# Altium schematic sheet 02_Block_Diagram.SchDoc
size A3; SheetNumber: 2; SheetTotal: 6
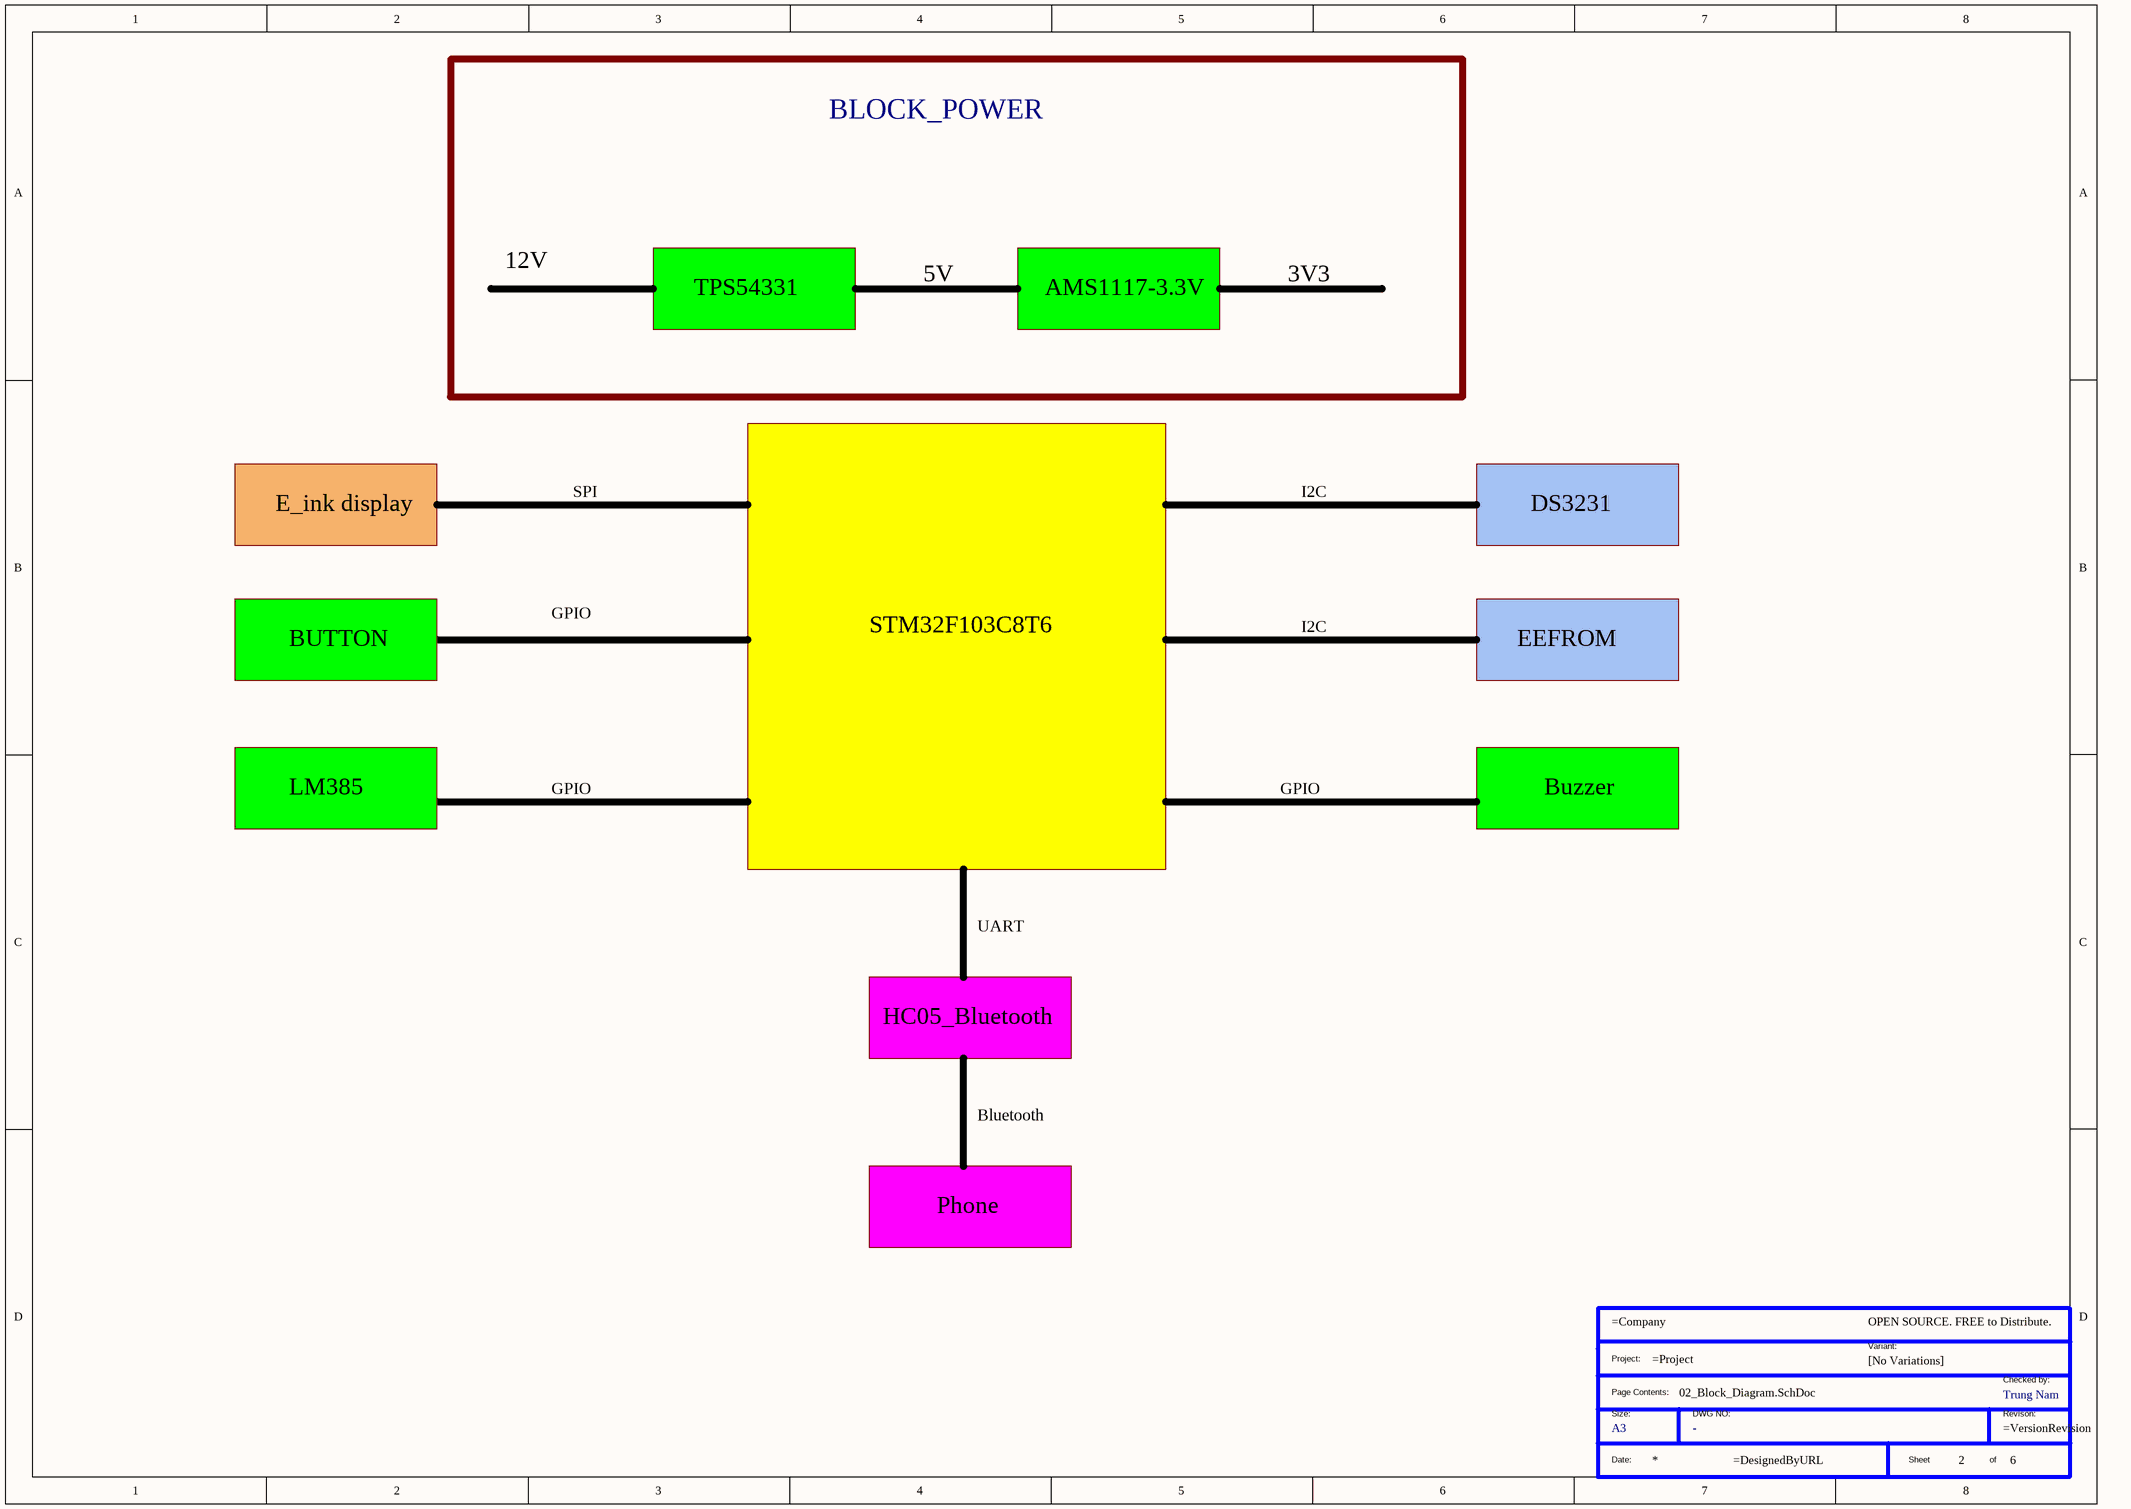
[diagram p0: 02_Block_Diagram.SchDoc]

## Parts
*?  Size: A3  Checked by: Trung Nam  (hidden comment: TitleBlock)  (graphical)

## Notes on the sheet
- BLOCK_POWER
- 12V
- TPS54331
- 5V
- AMS1117-3.3V
- 3V3
- E_ink display
- SPI
- I2C
- DS3231
- BUTTON
- GPIO
- STM32F103C8T6
- EEFROM
- LM385
- Buzzer
- UART
- HC05_Bluetooth
- Bluetooth
- Phone
- (in symbol TitleBlock) OPEN SOURCE. FREE to Distribute.; Project:; Variant:; [No Variations]; Checked by:; Page Contents:; Size:; DWG NO:; Revison:; Date:; Sheet; of

## Library data of the parts
*? = TitleBlock: Standard Title Block; DWG NO: -